# EAGLE design rpzc_1 (EAGLE 6.4)
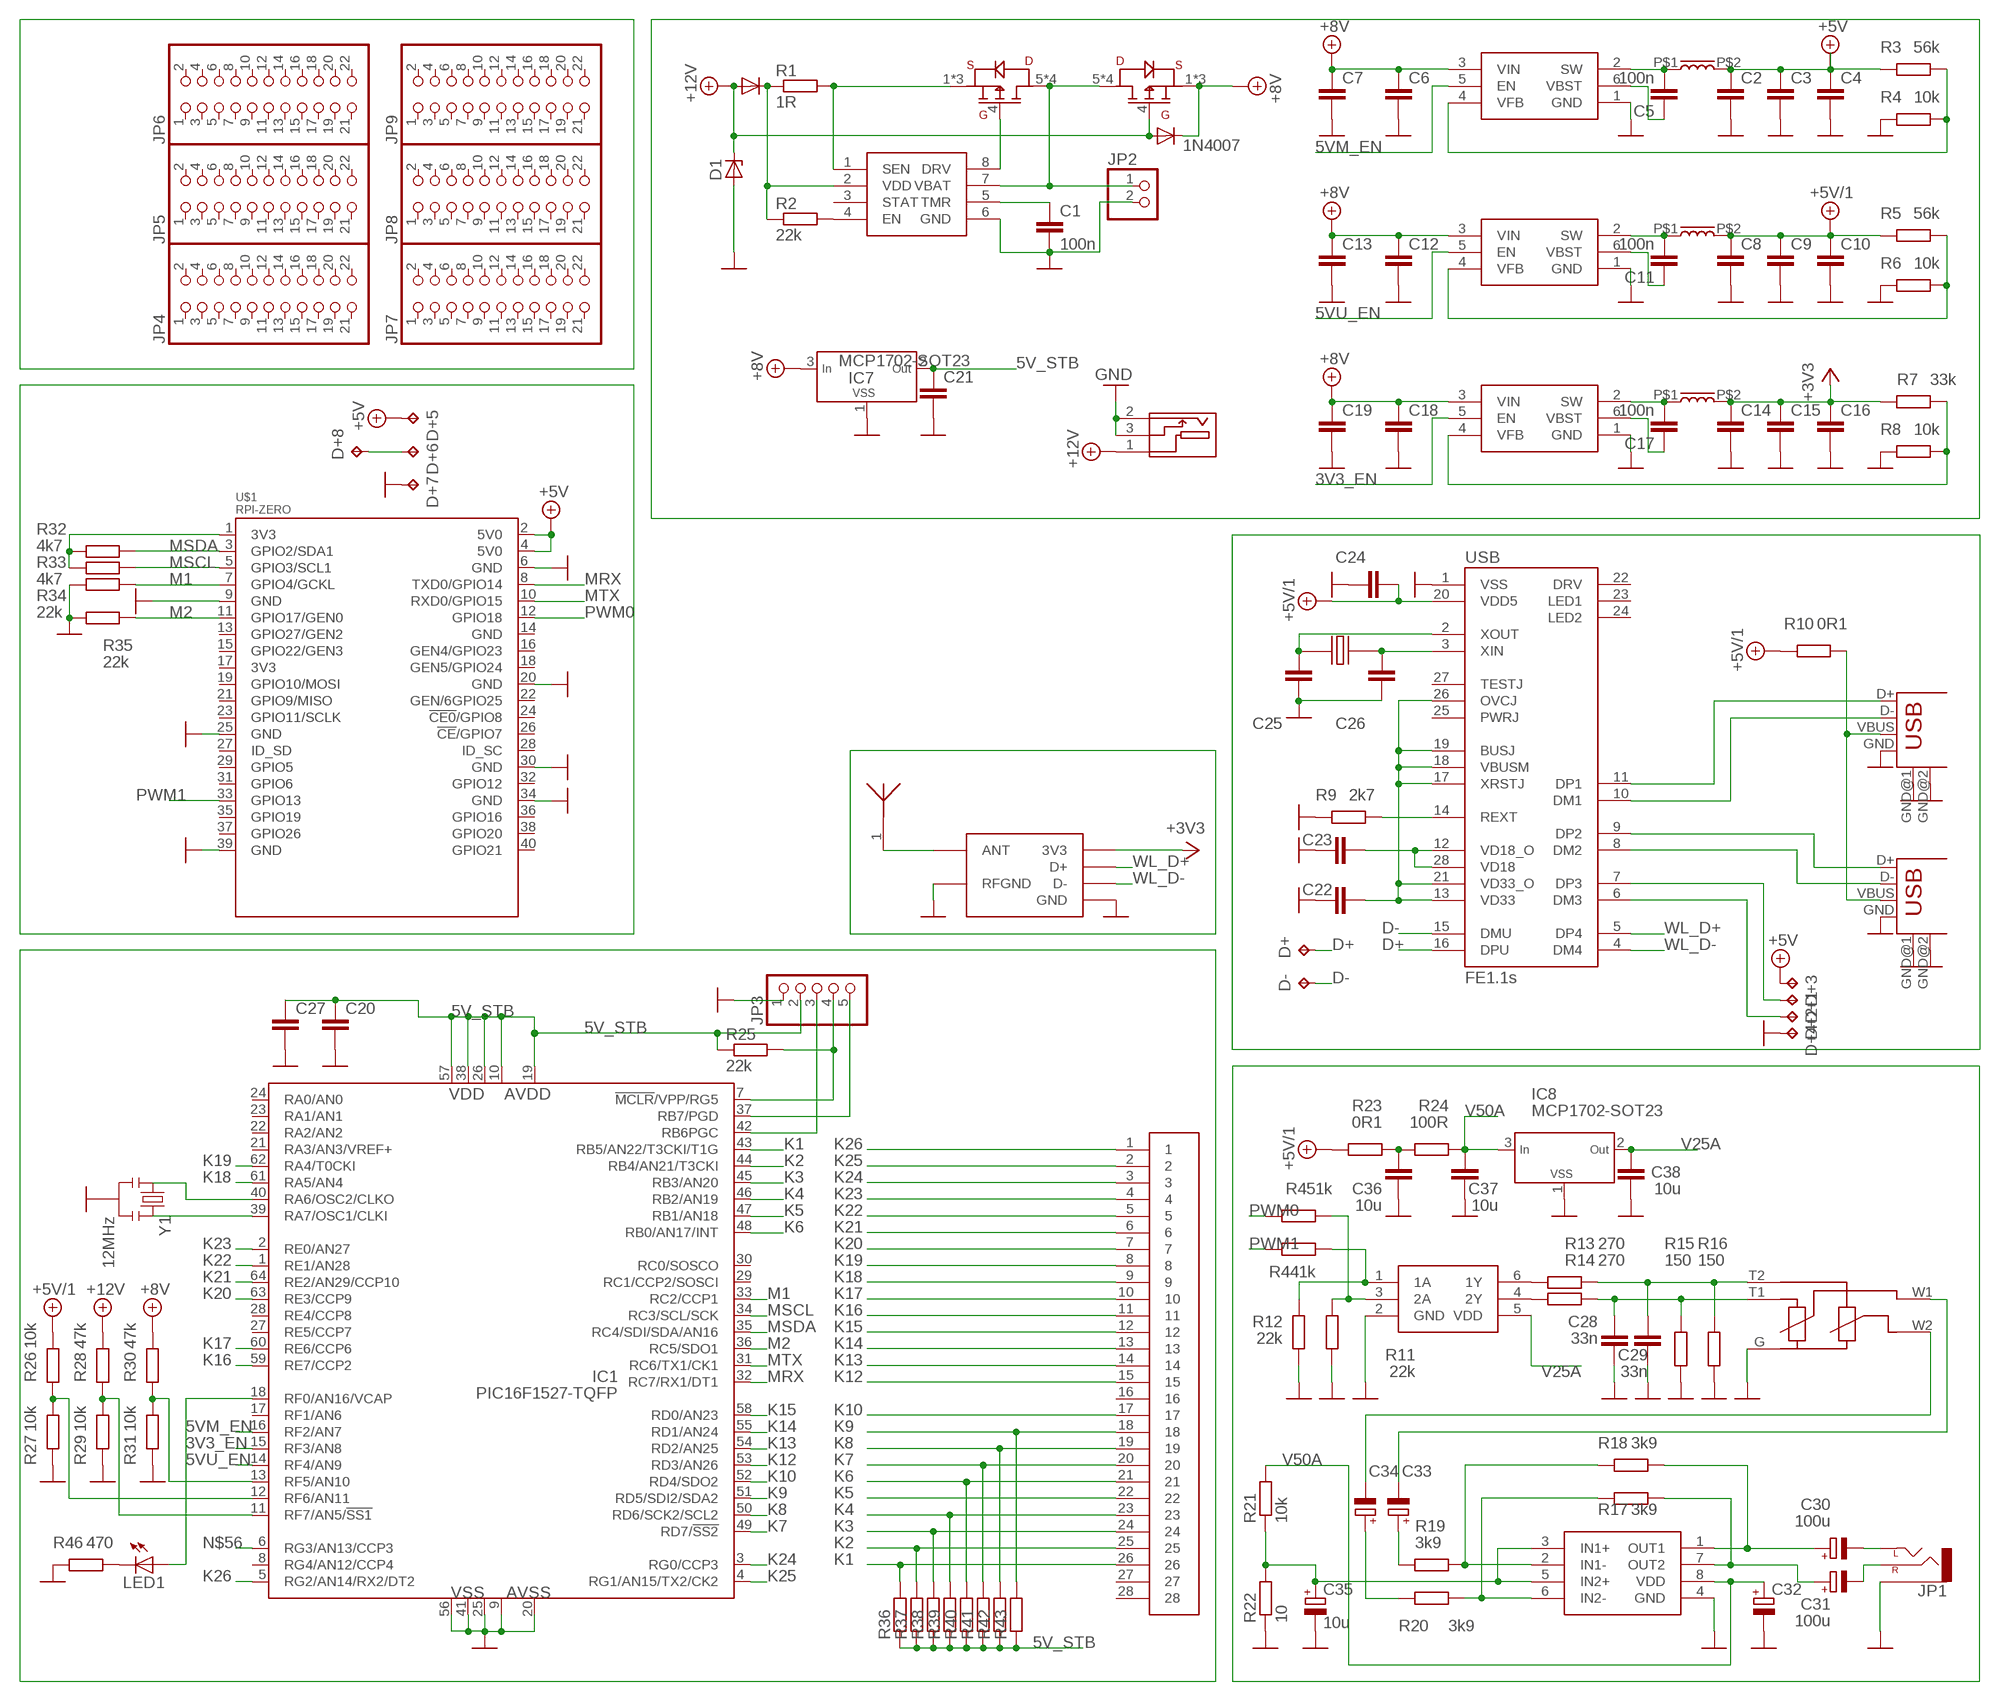
[diagram p0: schematic, sheet 1]

## Parts
ANT1  ANT_RAINSUN_24GHZ  [ANT_RAINSUN-24G]
C1  100n  C_0806  [R0805]
C2  C_0806  [R0805]
C3  C_0806  [R0805]
C4  C_0806  [R0805]
C5  100n  C_0806  [R0805]
C6  C_0806  [R0805]
C7  C_0806  [R0805]
C8  C_0806  [R0805]
C9  C_0806  [R0805]
C10  C_0806  [R0805]
C11  100n  C_0806  [R0805]
C12  C_0806  [R0805]
C13  C_0806  [R0805]
C14  C_0806  [R0805]
C15  C_0806  [R0805]
C16  C_0806  [R0805]
C17  100n  C_0806  [R0805]
C18  C_0806  [R0805]
C19  C_0806  [R0805]
C20  C_0806  [R0805]
C21  C_0806  [R0805]
C22  C_0806  [R0805]
C23  C_0806  [R0805]
C24  C_0806  [R0805]
C25  C_0806  [R0805]
C26  C_0806  [R0805]
C27  C_0806  [R0805]
C28  33n  C_0806  [R0805]
C29  33n  C_0806  [R0805]
C30  100u  CPOL-EUD  [PANASONIC_D]
C31  100u  CPOL-EUD  [PANASONIC_D]
C32  CPOL-EUD  [PANASONIC_D]
C33  CPOL-EUB  [PANASONIC_B]
C34  CPOL-EUB  [PANASONIC_B]
C35  10u  CPOL-EUB  [PANASONIC_B]
C36  10u  C_0806  [R0805]
C37  10u  C_0806  [R0805]
C38  10u  C_0806  [R0805]
CON1  CONN-28_1_K  [CONN_FFC_28_1_K]
D1  ZENER-DIODESMB  [SMB]
D2  1N4007  DIODE-SMB  [SMB]
D5  DIODE-SMB  [SMB]
D+  TPTP14R  [TP14R]
D+1  TPTP14R  [TP14R]
D+2  TPTP14R  [TP14R]
D+3  TPTP14R  [TP14R]
D+4  TPTP14R  [TP14R]
D+5  TPTP14R  [TP14R]
D+6  TPTP14R  [TP14R]
D+7  TPTP14R  [TP14R]
D+8  TPTP14R  [TP14R]
D-  TPTP14R  [TP14R]
IC1  PIC16F1527-TQFP  [TQFP64-10X10]
IC2  74LVC2G34  [SOT23-6]
IC3  TPS562200  [SOT23-6]
IC4  MCP73844  [MSOP8]
IC5  TPS562200  [SOT23-6]
IC6  TPS562200  [SOT23-6]
IC7  MCP1702-SOT23  [SOT23]
IC8  MCP1702-SOT23  [SOT23]
JP1  AUDIO-JACKPTH  [AUDIO-JACK]
JP2  PINHD-1X02_2.54-90°  [1X02/90]
JP3  PINHD-1X05_2.00  [1X05M]
JP4  PINHD-2X11_2.54  [2X11]
JP5  PINHD-2X11_2.54  [2X11]
JP6  PINHD-2X11_2.54  [2X11]
JP7  PINHD-2X11_2.54  [2X11]
JP8  PINHD-2X11_2.54  [2X11]
JP9  PINHD-2X11_2.54  [2X11]
LED1  LEDCHIPLED_0805  [CHIPLED_0805]
MOD1  MOD_USB_RTL8188  [MOD_USB_RTL8188]
R1  1R  R_1206  [R1206]
R2  22k  R_0805  [R0805]
R3  56k  R_0805  [R0805]
R4  10k  R_0805  [R0805]
R5  56k  R_0805  [R0805]
R6  10k  R_0805  [R0805]
R7  33k  R_0805  [R0805]
R8  10k  R_0805  [R0805]
R9  2k7  R_0805  [R0805]
R10  0R1  R_1206  [R1206]
R11  22k  R_0805  [R0805]
R12  22k  R_0805  [R0805]
R13  270  R_0805  [R0805]
R14  270  R_0805  [R0805]
R15  150  R_0805  [R0805]
R16  150  R_0805  [R0805]
R17  3k9  R_0805  [R0805]
R18  3k9  R_0805  [R0805]
R19  3k9  R_0805  [R0805]
R20  3k9  R_0805  [R0805]
R21  10k  R_0805  [R0805]
R22  10  R_0805  [R0805]
R23  0R1  R_1206  [R1206]
R24  100R  R_0805  [R0805]
R25  22k  R_0805  [R0805]
R26  10k  R_0805  [R0805]
R27  10k  R_0805  [R0805]
R28  47k  R_0805  [R0805]
R29  10k  R_0805  [R0805]
R30  47k  R_0805  [R0805]
R31  10k  R_0805  [R0805]
R32  4k7  R_0805  [R0805]
R33  4k7  R_0805  [R0805]
R34  22k  R_0805  [R0805]
R35  22k  R_0805  [R0805]
R36  R_0805  [R0805]
R37  R_0805  [R0805]
R38  R_0805  [R0805]
R39  R_0805  [R0805]
R40  R_0805  [R0805]
R41  R_0805  [R0805]
R42  R_0805  [R0805]
R43  R_0805  [R0805]
R44  1k  R_0805  [R0805]
R45  1k  R_0805  [R0805]
R46  470  R_0805  [R0805]
T1  PFET_SO8  [SO-08]
T2  PFET_SO8  [SO-08]
U$1  RPI-ZERO  [RASPBERRYPI_BASTELSTUBE_V13_RASPI_BOARD_B+_FULL]
U$2  POT_DUAL_14X2  [POT_14X2DUAL]
U$3  TDA1308  [SO-08]
U$4  2u2  INDUCTORBOURNS_SRP7030  [BOURNS_SRP7030]
U$5  2u2  INDUCTORBOURNS_SRP7030  [BOURNS_SRP7030]
U$6  CONN_DC_13  [CON_DC13]
U$8  2u2  INDUCTORBOURNS_SRP7030  [BOURNS_SRP7030]
USB  FE1.1S  [FE1.1S_SSOP-28]
USB1  USB-A-H  [USB-A-H]
USB2  USB-A-H  [USB-A-H]
X1  CRYST_TC26TC38  [TC38]
Y1  12MHz  RESONATORSMD  [RESONATOR-SMD]

## Nets
3V3@1: R32.1 R33.1 U$1.1(3V3)
3V3_EN: IC1.15(RF3/AN8) IC6.5(EN)
5V_STB: C20.1 C21.1 C27.1 IC1.10(VDD) IC1.19(AVDD) IC1.26(VDD) IC1.38(VDD) IC1.57(VDD) IC7.2(OUT) JP3.2 R25.1 R36.1 R37.1 R38.1 R39.1 R40.1 R41.1 R42.1 R43.1
5VM_EN: IC1.16(RF2/AN7) IC3.5(EN)
5VU_EN: IC1.14(RF4/AN9) IC5.5(EN)
+3V3: C14.1 C15.1 C16.1 MOD1.3V3 R7.1 U$5.P$2
+5V: C2.1 C3.1 C4.1 D+3.TP D+5.TP R3.1 U$1.2(5V0) U$1.4(5V0) U$8.P$2
+5V/1: C8.1 C9.1 C10.1 C24.2 R5.1 R10.2 R23.2 R26.2 U$4.P$2 USB.20(VDD5)
+8V: C6.1 C7.1 C12.1 C13.1 C18.1 C19.1 D2.C IC3.3(VIN) IC5.3(VIN) IC6.3(VIN) IC7.3(IN) R30.2 T2.1(S) T2.2(S) T2.3(S)
+12V: D1.C D2.A D5.A R28.2 T2.4(G) U$6.1(P)
D+: D+.TP USB.16(DPU)
D-: D-.TP USB.15(DMU)
GND: C1.2 C2.2 C3.2 C4.2 C6.2 C7.2 C8.2 C9.2 C10.2 C12.2 C13.2 C14.2 C15.2 C16.2 C18.2 C19.2 C20.2 C21.2 C22.1 C23.1 C24.1 C25.1 C26.1 C27.2 C28.1 C29.1 C32.- C35.- C36.1 C37.1 C38.1 D1.A D+4.TP D+7.TP IC1.9(VSS) IC1.20(AVSS) IC1.25(VSS) IC1.41(VSS) IC1.56(VSS) IC2.2(GND) IC3.1(GND) IC4.6(GND) IC5.1(GND) IC6.1(GND) IC7.1(VSS) IC8.1(VSS) JP1.SLEEVE JP2.2 JP3.1 MOD1.GND MOD1.RFGND R4.1 R6.1 R8.1 R9.1 R11.1 R12.1 R15.2 R16.2 R22.1 R27.1 R29.1 R31.1 R34.1 R35.1 R46.1 U$1.6(GND) U$1.9(GND) U$1.20(GND) U$1.25(GND) U$1.30(GND) U$1.34(GND) U$1.39(GND) U$2.G U$3.4(GND) U$6.2(N) U$6.3(SW) USB1.GND USB1.GND@1(GND) USB1.GND@2(GND) USB2.GND USB2.GND@1(GND) USB2.GND@2(GND) USB.1(VSS) Y1.2
K1: CON1.26 IC1.43(RB5/AN22/T3CKI/T1G) R36.2
K2: CON1.25 IC1.44(RB4/AN21/T3CKI) R37.2
K3: CON1.24 IC1.45(RB3/AN20) R38.2
K4: CON1.23 IC1.46(RB2/AN19) R39.2
K5: CON1.22 IC1.47(RB1/AN18)
K6: CON1.21 IC1.48(RB0/AN17/INT) R40.2
K7: CON1.20 IC1.49(RD7/!SS2) R41.2
K8: CON1.19 IC1.50(RD6/SCK2/SCL2) R42.2
K9: CON1.18 IC1.51(RD5/SDI2/SDA2) R43.2
K10: CON1.17 IC1.52(RD4/SDO2)
K12: CON1.15 IC1.53(RD3/AN26)
K13: CON1.14 IC1.54(RD2/AN25)
K14: CON1.13 IC1.55(RD1/AN24)
K15: CON1.12 IC1.58(RD0/AN23)
K16: CON1.11 IC1.59(RE7/CCP2)
K17: CON1.10 IC1.60(RE6/CCP6)
K18: CON1.9 IC1.61(RA5/AN4)
K19: CON1.8 IC1.62(RA4/T0CKI)
K20: CON1.7 IC1.63(RE3/CCP9)
K21: CON1.6 IC1.64(RE2/AN29/CCP10)
K22: CON1.5 IC1.1(RE1/AN28)
K23: CON1.4 IC1.2(RE0/AN27)
K24: CON1.3 IC1.3(RG0/CCP3)
K25: CON1.2 IC1.4(RG1/AN15/TX2/CK2)
K26: CON1.1 IC1.5(RG2/AN14/RX2/DT2)
M1: IC1.33(RC2/CCP1) R34.2 U$1.7(GPIO4/GCKL)
M2: IC1.36(RC5/SDO1) R35.2 U$1.11(GPIO17/GEN0)
MRX: IC1.32(RC7/RX1/DT1) U$1.8(TXD0/GPIO14)
MSCL: IC1.34(RC3/SCL/SCK) R33.2 U$1.5(GPIO3/SCL1)
MSDA: IC1.35(RC4/SDI/SDA/AN16) R32.2 U$1.3(GPIO2/SDA1)
MTX: IC1.31(RC6/TX1/CK1) U$1.10(RXD0/GPIO15)
N$1: C5.2 IC3.2(SW) U$8.P$1
N$2: D5.C IC4.2(VDD) R1.1 R2.1
N$3: IC4.1(SEN) R1.2 T1.1(S) T1.2(S) T1.3(S)
N$4: IC4.8(DRV) T1.4(G)
N$5: IC4.4(EN) R2.2
N$6: C1.1 IC4.5(TMR)
N$7: IC4.7(VBAT) JP2.1 T1.5(D) T1.6(D) T1.7(D) T1.8(D) T2.5(D) T2.6(D) T2.7(D) T2.8(D)
N$8: USB2.D+ USB.9(DP2)
N$9: USB2.D- USB.8(DM2)
N$10: USB1.D- USB.10(DM1)
N$11: USB1.D+ USB.11(DP1)
N$12: C22.2 USB.13(VD33) USB.17(XRSTJ) USB.18(VBUSM) USB.19(BUSJ) USB.21(VD33_O) USB.26(OVCJ)
N$13: C5.1 IC3.6(VBST)
N$14: IC3.4(VFB) R3.2 R4.2
N$15: C23.2 USB.12(VD18_O) USB.28(VD18)
N$16: R9.2 USB.14(REXT)
N$17: C11.2 IC5.2(SW) U$4.P$1
N$18: C25.2 USB.2(XOUT) X1.P$1
N$19: C11.1 IC5.6(VBST)
N$20: IC5.4(VFB) R5.2 R6.2
N$21: C26.2 USB.3(XIN) X1.P$2
N$22: C17.2 IC6.2(SW) U$5.P$1
N$23: R10.1 USB1.VBUS USB2.VBUS
N$24: C17.1 IC6.6(VBST)
N$25: IC6.4(VFB) R7.2 R8.2
N$29: IC2.6(1Y) R13.2
N$30: IC2.4(2Y) R14.2
N$31: C29.2 R13.1 R16.1 U$2.T2
N$32: C28.2 R14.1 R15.1 U$2.T1
N$33: ANT1.1 MOD1.ANT
N$34: C30.- JP1.TIP(LEFT)
N$35: C31.- JP1.RING(RIGHT)
N$36: C30.+ R18.2 U$3.1(OUT1)
N$37: C31.+ R17.2 U$3.7(OUT2)
N$38: C35.+ R21.1 R22.2 U$3.3(IN1+) U$3.5(IN2+)
N$39: R18.1 R19.2 U$3.2(IN1-)
N$40: R17.1 R20.2 U$3.6(IN2-)
N$41: C33.+ R19.1
N$42: C34.+ R20.1
N$43: C34.- U$2.W2
N$44: C33.- U$2.W1
N$45: D+1.TP USB.7(DP3)
N$46: D+2.TP USB.6(DM3)
N$47: C36.2 R23.1 R24.1
N$48: IC1.12(RF6/AN11) R26.1 R27.2
N$49: IC1.7(!MCLR!/VPP/RG5) JP3.4 R25.2
N$50: IC1.37(RB7/PGD) JP3.5
N$51: IC1.42(RB6PGC) JP3.3
N$52: IC1.11(RF7/AN5/!SS1) R28.1 R29.2
N$53: IC1.40(RA6/OSC2/CLKO) Y1.1
N$54: IC1.39(RA7/OSC1/CLKI) Y1.3
N$55: IC1.13(RF5/AN10) R30.1 R31.2
N$56: IC1.6(RG3/AN13/CCP3)
N$57: D+6.TP D+8.TP
N$58: IC2.3(2A) R11.2 R45.1
N$59: IC2.1(1A) R12.2 R44.1
N$60: LED1.C R46.2
N$61: IC1.18(RF0/AN16/VCAP) LED1.A
PWM0: R45.2 U$1.12(GPIO18)
PWM1: R44.2 U$1.33(GPIO13)
V25A: C38.2 IC2.5(VDD) IC8.2(OUT)
V50A: C32.+ C37.2 IC8.3(IN) R21.2 R24.2 U$3.8(VDD)
WL_D+: MOD1.D+ USB.5(DP4)
WL_D-: MOD1.D- USB.4(DM4)
Unconnected: CON1.16 CON1.27 CON1.28 IC1.8(RG4/AN12/CCP4) IC1.17(RF1/AN6) IC1.21(RA3/AN3/VREF+) IC1.22(RA2/AN2) IC1.23(RA1/AN1) IC1.24(RA0/AN0) IC1.27(RE5/CCP7) IC1.28(RE4/CCP8) IC1.29(RC1/CCP2/SOSCI) IC1.30(RC0/SOSCO) IC4.3(STAT) JP4.1 JP4.2 JP4.3 JP4.4 JP4.5 JP4.6 JP4.7 JP4.8 JP4.9 JP4.10 JP4.11 JP4.12 JP4.13 JP4.14 JP4.15 JP4.16 JP4.17 JP4.18 JP4.19 JP4.20 JP4.21 JP4.22 JP5.1 JP5.2 JP5.3 JP5.4 JP5.5 JP5.6 JP5.7 JP5.8 JP5.9 JP5.10 JP5.11 JP5.12 JP5.13 JP5.14 JP5.15 JP5.16 JP5.17 JP5.18 JP5.19 JP5.20 JP5.21 JP5.22 JP6.1 JP6.2 JP6.3 JP6.4 JP6.5 JP6.6 JP6.7 JP6.8 JP6.9 JP6.10 JP6.11 JP6.12 JP6.13 JP6.14 JP6.15 JP6.16 JP6.17 JP6.18 JP6.19 JP6.20 JP6.21 JP6.22 JP7.1 JP7.2 JP7.3 JP7.4 JP7.5 JP7.6 JP7.7 JP7.8 JP7.9 JP7.10 JP7.11 JP7.12 JP7.13 JP7.14 JP7.15 JP7.16 JP7.17 JP7.18 JP7.19 JP7.20 JP7.21 JP7.22 JP8.1 JP8.2 JP8.3 JP8.4 JP8.5 JP8.6 JP8.7 JP8.8 JP8.9 JP8.10 JP8.11 JP8.12 JP8.13 JP8.14 JP8.15 JP8.16 JP8.17 JP8.18 JP8.19 JP8.20 JP8.21 JP8.22 JP9.1 JP9.2 JP9.3 JP9.4 JP9.5 JP9.6 JP9.7 JP9.8 JP9.9 JP9.10 JP9.11 JP9.12 JP9.13 JP9.14 JP9.15 JP9.16 JP9.17 JP9.18 JP9.19 JP9.20 JP9.21 JP9.22 U$1.13(GPIO27/GEN2) U$1.14(GND) U$1.15(GPIO22/GEN3) U$1.16(GEN4/GPIO23) U$1.17(3V3) U$1.18(GEN5/GPIO24) U$1.19(GPIO10/MOSI) U$1.21(GPIO9/MISO) U$1.22(GEN/6GPIO25) U$1.23(GPIO11/SCLK) U$1.24(!CE0!/GPIO8) U$1.26(!CE!/GPIO7) U$1.27(ID_SD) U$1.28(ID_SC) U$1.29(GPIO5) U$1.31(GPIO6) U$1.32(GPIO12) U$1.35(GPIO19) U$1.36(GPIO16) U$1.37(GPIO26) U$1.38(GPIO20) U$1.40(GPIO21) USB.22(DRV) USB.23(LED1) USB.24(LED2) USB.25(PWRJ) USB.27(TESTJ)

## Library data of the parts
ANT1 = _moja:ANT_RAINSUN_24GHZ
C1-C29 C36-C38 = _moja:C
C30-C35 = _rcl:CPOL-EU: POLARIZED CAPACITOR, European symbol
CON1 = _moja:CONN-28_1_K
D1 = diode:ZENER-DIODE: Z-Diode
D2 D5 = diode:DIODE-: DIODE
D+ D+1-D+8 D- = testpad:TP: Test pad
IC1 = _mcom5:PIC16F1527
IC2 = _mcom6:74LVC2G34
IC3 IC5 IC6 = _mcom6:TPS562200
IC4 = _mcom6:MCP73844
IC7 IC8 = _mcom6:MCP1702
JP1 = SparkFun-Connectors:AUDIO-JACK: 3.5mm Audio Jack Simple 3.5mm common PCB mount audio jack. SKU: PRT-08032
JP2 = pinhead-2:PINHD-1X02: PIN HEADER
JP3 = pinhead-2:PINHD-1X05: PIN HEADER
JP4-JP9 = pinhead-2:PINHD-2X11: PIN HEADER
LED1 = led:LED: LED OSRAM: - CHIPLED LG R971, LG N971, LY N971, LG Q971, LY Q971, LO R971, LY R971 LH N974, LH R974 LS Q976, LO Q976, LY Q976 LO Q996 - Hyper CHIPLED LW Q18S LB Q993, LB Q99A, LB R99A - SideLED LS A670, LO A670, LY A670, LG A670, LP A670 LB A673, LV A673, LT A673, LW A673 LH A674 LY A675 LS A676, LA A676, LO A676, LY A676, LW A676 LS A679, LY A679, LG A679 - Hyper Micro SIDELED® LS Y876, LA Y876, LO Y876, LY Y876 LT Y87S - SmartLED LW L88C, LW L88S LB L89C, LB L89S, LG L890 LS L89K, LO L89K, LY L89K LS L896, LA L896, LO L896, LY L896 - TOPLED LS T670, LO T670, LY T670, LG T670, LP T670 LSG T670, LSP T670, LSY T670, LOP T670, LYG T670 LG T671, LOG T671, LSG T671 LB T673, LV T673, LT T673, LW T673 LH T674 LS T676, LA T676, LO T676, LY T676, LB T676, LH T676, LSB T676, LW T676 LB T67C, LV T67C, LT T67C, LS T67K, LO T67K, LY T67K, LW E67C LS E67B, LA E67B, LO E67B, LY E67B, LB E67C, LV E67C, LT E67C LW T67C LS T679, LY T679, LG T679 LS T770, LO T770, LY T770, LG T770, LP T770 LB T773, LV T773, LT T773, LW T773 LH T774 LS E675, LA E675, LY E675, LS T675 LS T776, LA T776, LO T776, LY T776, LB T776 LHGB T686 LT T68C, LB T68C - Hyper Mini TOPLED® LB M676 - Mini TOPLED Santana® LG M470 LS M47K, LO M47K, LY M47K Source: http://www.osram.convergy.de LUXEON: - LUMILED® LXK2-PW12-R00, LXK2-PW12-S00, LXK2-PW14-U00, LXK2-PW14-V00 LXK2-PM12-R00, LXK2-PM12-S00, LXK2-PM14-U00 LXK2-PE12-Q00, LXK2-PE12-R00, LXK2-PE12-S00, LXK2-PE14-T00, LXK2-PE14-U00 LXK2-PB12-K00, LXK2-PB12-L00, LXK2-PB12-M00, LXK2-PB14-N00, LXK2-PB14-P00, LXK2-PB14-Q00 LXK2-PR12-L00, LXK2-PR12-M00, LXK2-PR14-Q00, LXK2-PR14-R00 LXK2-PD12-Q00, LXK2-PD12-R00, LXK2-PD12-S00 LXK2-PH12-R00, LXK2-PH12-S00 LXK2-PL12-P00, LXK2-PL12-Q00, LXK2-PL12-R00 Source: www.luxeon.com KINGBRIGHT: KA-3528ASYC Source: www.kingbright.com
MOD1 = _moja:MOD_USB_RTL8188
R1-R46 = _moja:R
T1 T2 = _mcom6:PFET_SO8
U$1 = RPI-Zero:RPI-ZERO
U$2 = _moja:POT_DUAL_14X2
U$3 = _mcom6:TDA1308
U$4 U$5 U$8 = _mcs1:INDUCTOR
U$6 = _moja:CONN_DC_13
USB = imcom:FE1.1S: A USB 2.0 hub IC. http://www.jfd-ic.com/Documents/FE1.1s%20Data%20Sheet%20%28Rev.%201.0%29.pdf
USB1 USB2 = con-usb-2:USB: USB Connectors
X1 = _moja:CRYST_TC26
Y1 = SparkFun:RESONATOR: Resonator Small SMD resonator. This is the itty bitty 10/20MHz resonators with built in caps. CSTCE10M0G55 and CSTCE20M0V53. Footprint has been reviewed closely but hasn't been tested yet.

## Board
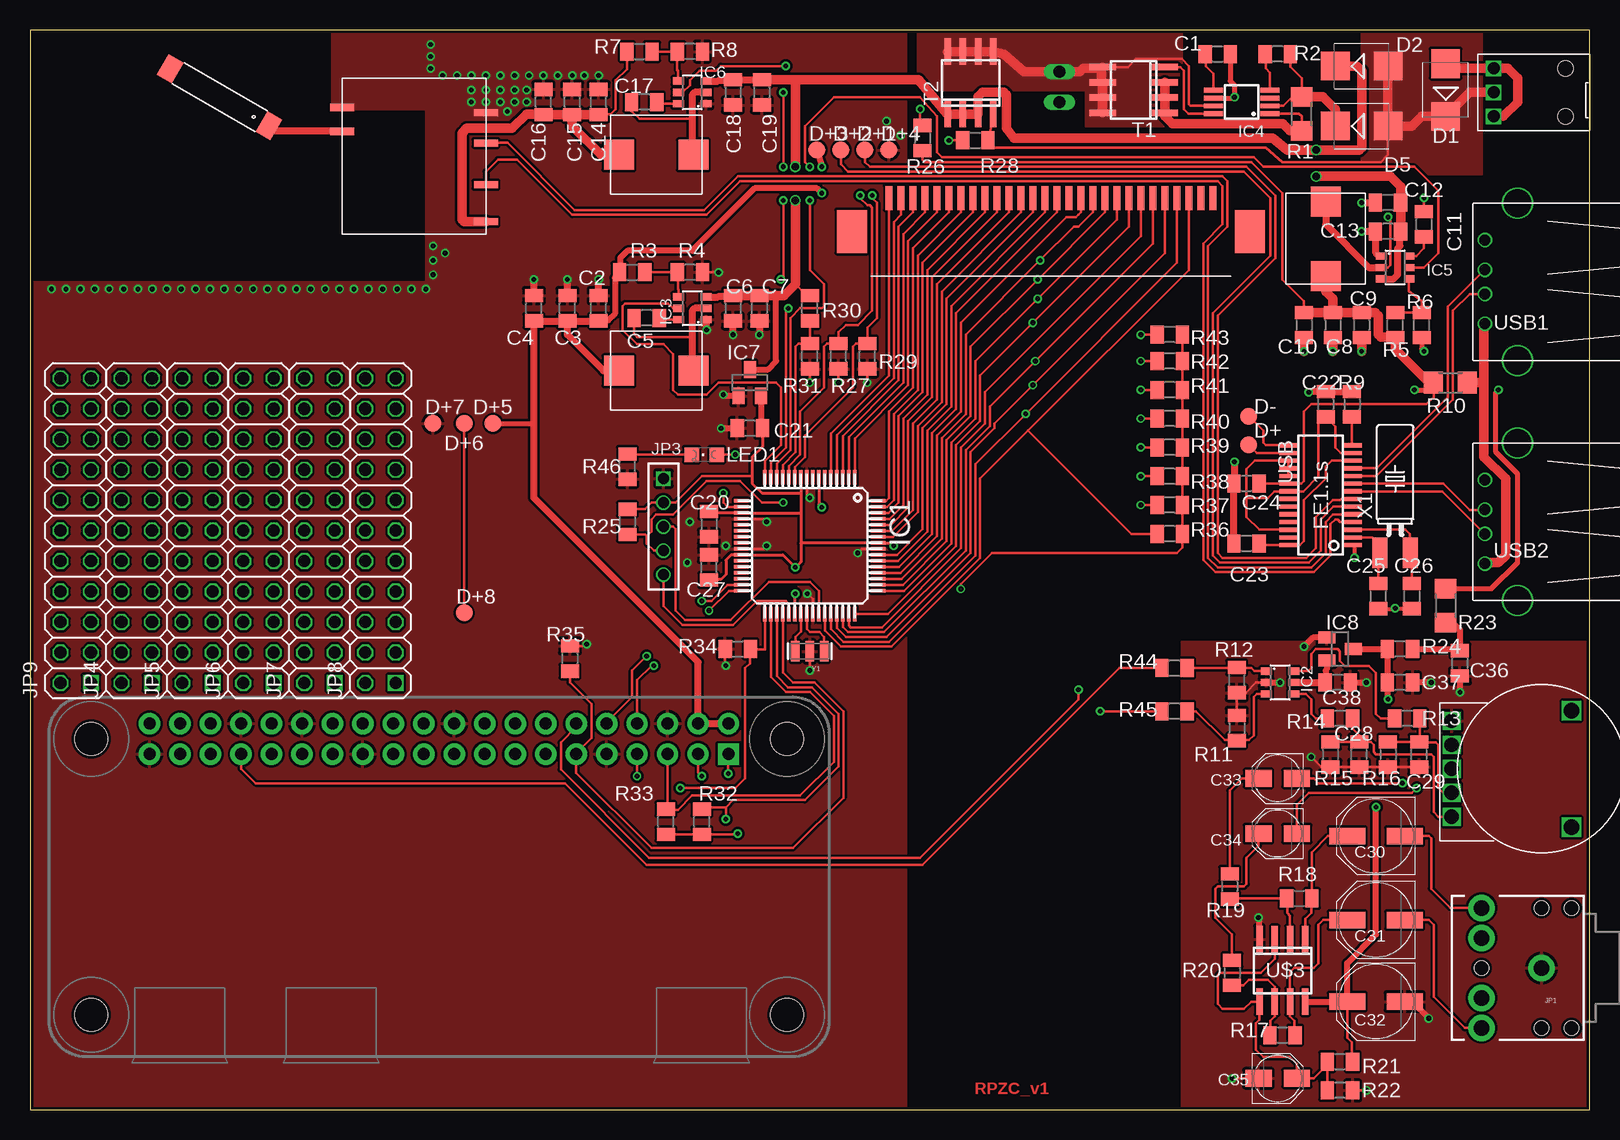
[diagram p1: board, top side]
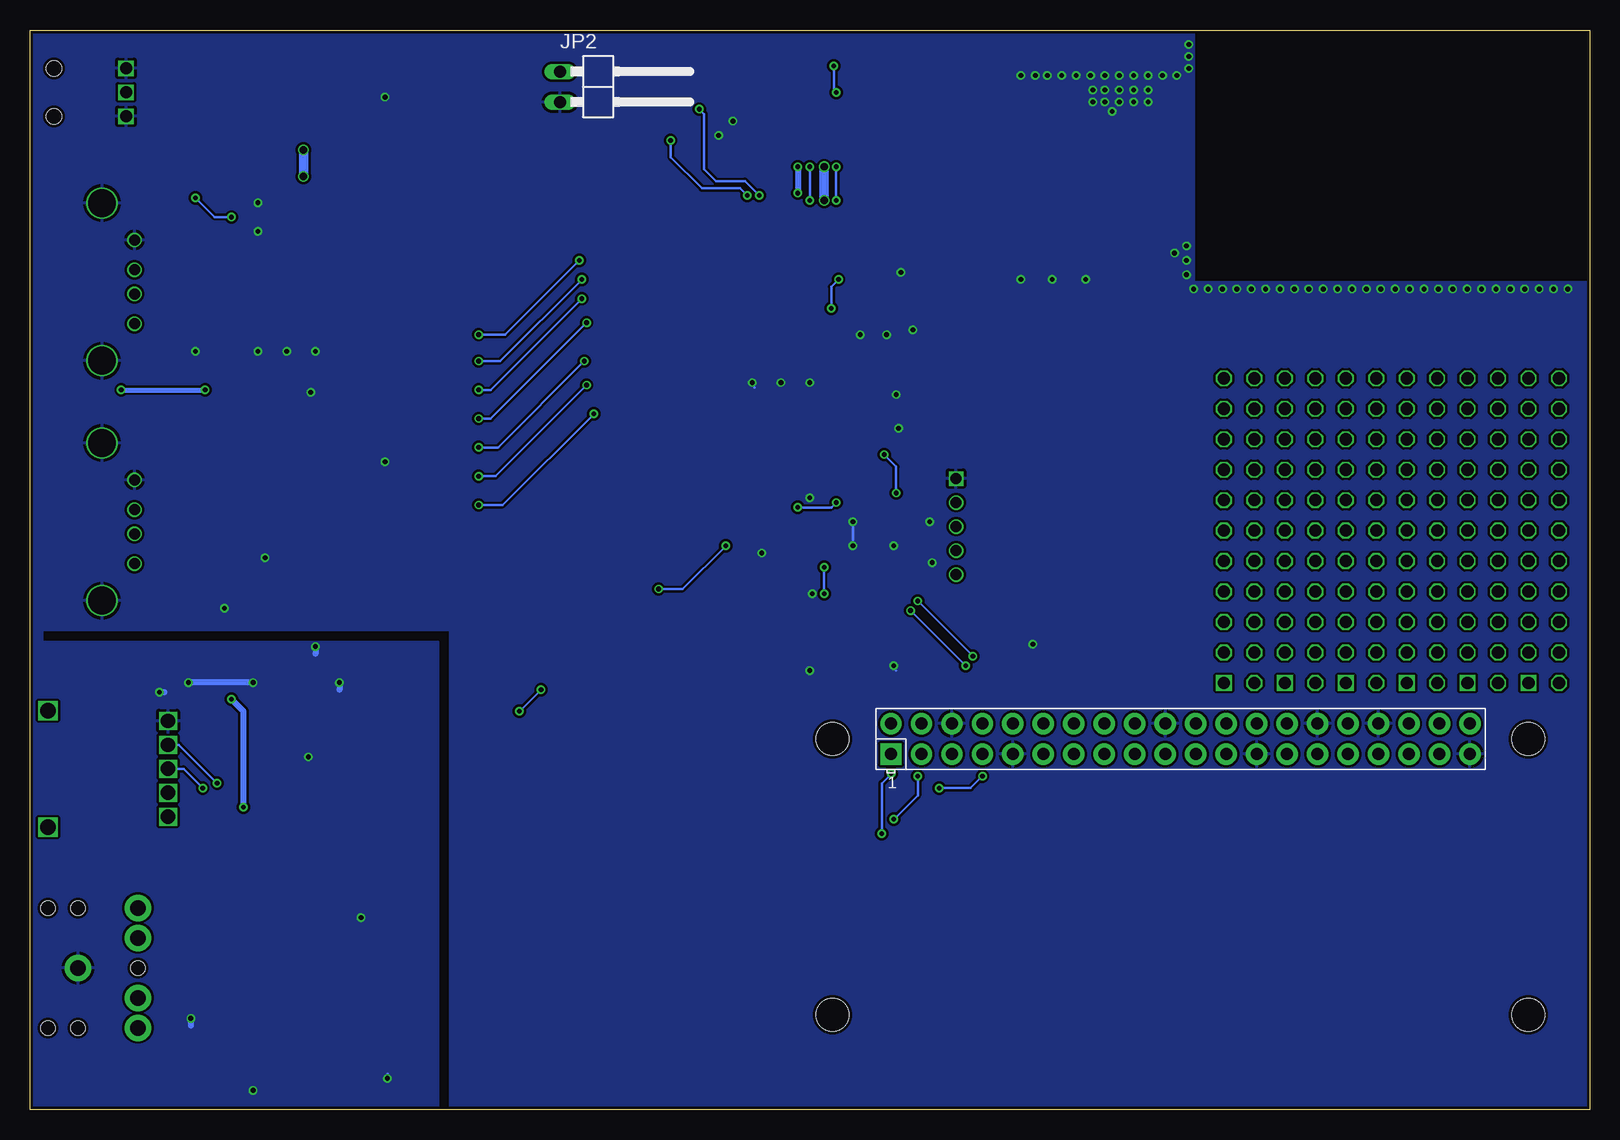
[diagram p2: board, bottom side, seen from below]

Size 130 x 90 mm. Coordinates in mm from the lower left corner, seen from the top.
Outline: 0,0 130,0 130,90 0,90 0,0
Copper layers (1*16): Top 0.035mm / dielectric 1.5mm / Bottom 0.035mm
Design rules "ch_6": minimum track width 0.15mm, minimum drill 0.4mm, track to track 0.2mm, track to pad 0.2mm, pad to pad 0.2mm, via to via 0.2mm, smd to smd 0.2mm, copper to edge 10mil, drill to drill 8mil, minimum pad ring 0.15mm, minimum via ring 0.15mm, stop-mask expansion 4mil, vias tented up to drill 0mil, thermal gap 10mil

### Footprints (pad centres in the part's own frame; a part is rotated, then mirrored left to right if it is on the bottom)
ANT_RAINSUN-24G = smd 2 x 1.4: 1 0,-4.75; 2 0,4.75
R0805 = smd 1.1 x 1.5: 1 -1.05,0; 2 1.05,0
PANASONIC_D = smd 3 x 1.4: + 2.4,0; - -2.4,0
PANASONIC_B = smd 2.2 x 1.4: + 1.6,0; - -1.6,0
CONN_FFC_28_1_K = smd 0.6 x 2: 1 -13.5,1; 2 -12.5,1; 3 -11.5,1; 4 -10.5,1; 5 -9.5,1; 6 -8.5,1; 7 -7.5,1; 8 -6.5,1; 9 -5.5,1; 10 -4.5,1; 11 -3.5,1; 12 -2.5,1; 13 -1.5,1; 14 -0.5,1; 15 0.5,1; 16 1.5,1; 17 2.5,1; 18 3.5,1; 19 4.5,1; 20 5.5,1; 21 6.5,1; 22 7.5,1; 23 8.5,1; 24 9.5,1; 25 10.5,1; 26 11.5,1; 27 12.5,1; 28 13.5,1 | smd 2.5 x 3.6: T1 -16.6,-1.8; T2 16.6,-1.8
SMB = smd 2.4 x 2.4: A 2.2,0; C -2.2,0
TP14R = smd 1.4 x 1.4: TP 0,0
TQFP64-10X10 = smd 1.2 x 0.254: 1 -5.7,3.75; 2 -5.7,3.25; 3 -5.7,2.75; 4 -5.7,2.25; 5 -5.7,1.75; 6 -5.7,1.25; 7 -5.7,0.75; 8 -5.7,0.25; 9 -5.7,-0.25; 10 -5.7,-0.75; 11 -5.7,-1.25; 12 -5.7,-1.75; 13 -5.7,-2.25; 14 -5.7,-2.75; 15 -5.7,-3.25; 16 -5.7,-3.75; 33 5.7,-3.75; 34 5.7,-3.25; 35 5.7,-2.75; 36 5.7,-2.25; 37 5.7,-1.75; 38 5.7,-1.25; 39 5.7,-0.75; 40 5.7,-0.25; 41 5.7,0.25; 42 5.7,0.75; 43 5.7,1.25; 44 5.7,1.75; 45 5.7,2.25; 46 5.7,2.75; 47 5.7,3.25; 48 5.7,3.75 | smd 0.254 x 1.2: 17 -3.75,-5.7; 18 -3.25,-5.7; 19 -2.75,-5.7; 20 -2.25,-5.7; 21 -1.75,-5.7; 22 -1.25,-5.7; 23 -0.75,-5.7; 24 -0.25,-5.7; 25 0.25,-5.7; 26 0.75,-5.7; 27 1.25,-5.7; 28 1.75,-5.7; 29 2.25,-5.7; 30 2.75,-5.7; 31 3.25,-5.7; 32 3.75,-5.7; 49 3.75,5.7; 50 3.25,5.7; 51 2.75,5.7; 52 2.25,5.7; 53 1.75,5.7; 54 1.25,5.7; 55 0.75,5.7; 56 0.25,5.7; 57 -0.25,5.7; 58 -0.75,5.7; 59 -1.25,5.7; 60 -1.75,5.7; 61 -2.25,5.7; 62 -2.75,5.7; 63 -3.25,5.7; 64 -3.75,5.7
SOT23-6 = smd 0.6 x 0.9: 1 -0.95,-1.15; 2 0,-1.15; 3 0.95,-1.15; 4 0.95,1.15; 5 0,1.15; 6 -0.95,1.15
MSOP8 = smd 0.4 x 1.6: 1 -0.975,-2.35; 2 -0.325,-2.35; 3 0.325,-2.35; 4 0.975,-2.35; 5 0.975,2.35; 6 0.325,2.35; 7 -0.325,2.35; 8 -0.975,2.35
SOT23 = smd 1 x 1.4: 1 -0.95,-1.1; 2 0.95,-1.1; 3 0,1.1
AUDIO-JACK = drill 1.3 pad 2.184: RING 5,5; RSH 5,2.5; SLEEVE 0,0; TIP 5,-5; TSH 5,-2.5 | hole 1.2: 0,5; -2.5,5; -2.5,-5; 0,-5; 5,0
1X02/90 = drill 1 long: 1 -2.54,-3.81; 2 0,-3.81
1X05M = drill 0.914 square: 1 -4,0 | drill 0.914: 2 -2,0; 3 0,0; 4 2,0; 5 4,0
2X11 = drill 1.016 square: 1 -12.7,-1.27 | drill 1.016 octagon: 2 -12.7,1.27; 3 -10.16,-1.27; 4 -10.16,1.27; 5 -7.62,-1.27; 6 -7.62,1.27; 7 -5.08,-1.27; 8 -5.08,1.27; 9 -2.54,-1.27; 10 -2.54,1.27; 11 0,-1.27; 12 0,1.27; 13 2.54,-1.27; 14 2.54,1.27; 15 5.08,-1.27; 16 5.08,1.27; 17 7.62,-1.27; 18 7.62,1.27; 19 10.16,-1.27; 20 10.16,1.27; 21 12.7,-1.27; 22 12.7,1.27
CHIPLED_0805 = smd 1.2 x 1.2: A 0,-1.05; C 0,1.05
MOD_USB_RTL8188 = smd 2 x 0.6: 3V3 12,-11.98; ANT 0,-4.45; D+ 12,-5.425; D- 12,-8.9; GND 12,-2.903; RFGND 0,-2.45
R1206 = smd 1.6 x 1.803: 1 -1.422,0; 2 1.422,0
SO-08 = smd 0.55 x 2.2: 1 -1.905,-2.6; 2 -0.635,-2.6; 3 0.635,-2.6; 4 1.905,-2.6; 5 1.905,2.6; 6 0.635,2.6; 7 -0.635,2.6; 8 -1.905,2.6
RASPBERRYPI_BASTELSTUBE_V13_RASPI_BOARD_B+_FULL = drill 1 pad 1.778 square: 1 8.37,25.23 | drill 1 pad 1.778: 2 8.37,27.77; 3 10.91,25.23; 4 10.91,27.77; 5 13.45,25.23; 6 13.45,27.77; 7 15.99,25.23; 8 15.99,27.77; 9 18.53,25.23; 10 18.53,27.77; 11 21.07,25.23; 12 21.07,27.77; 13 23.61,25.23; 14 23.61,27.77; 15 26.15,25.23; 16 26.15,27.77; 17 28.69,25.23; 18 28.69,27.77; 19 31.23,25.23; 20 31.23,27.77; 21 33.77,25.23; 22 33.77,27.77; 23 36.31,25.23; 24 36.31,27.77; 25 38.85,25.23; 26 38.85,27.77; 27 41.39,25.23; 28 41.39,27.77; 29 43.93,25.23; 30 43.93,27.77; 31 46.47,25.23; 32 46.47,27.77; 33 49.01,25.23; 34 49.01,27.77; 35 51.55,25.23; 36 51.55,27.77; 37 54.09,25.23; 38 54.09,27.77; 39 56.63,25.23; 40 56.63,27.77 | hole 2.75: 3.5,3.5; 3.5,26.5; 61.5,3.5; 61.5,26.5
POT_14X2DUAL = drill 1.2 square: G -4,-7.5; T1 4,-7.5; T2 2,-7.5; W1 -2,-7.5; W2 0,-7.5 | drill 1.3 square: P$1 -4.85,2.5; P$2 4.85,2.5
BOURNS_SRP7030 = smd 2.5 x 2.5: P$1 3.1,0; P$2 -3.1,0
CON_DC13 = drill 1 square: 1 8,3.2; 2 8,1.2; 3 8,5.2 | hole 1.3: 2,5.2; 2,1.2
FE1.1S_SSOP-28 = smd 0.35 x 1.5: 1 -4.16,-2.7; 2 -3.52,-2.7; 3 -2.88,-2.7; 4 -2.24,-2.7; 5 -1.6,-2.7; 6 -0.96,-2.7; 7 -0.32,-2.7; 8 0.32,-2.7; 9 0.96,-2.7; 10 1.6,-2.7; 11 2.24,-2.7; 12 2.88,-2.7; 13 3.52,-2.7; 14 4.16,-2.7; 15 4.16,2.7; 16 3.52,2.7; 17 2.88,2.7; 18 2.24,2.7; 19 1.6,2.7; 20 0.96,2.7; 21 0.32,2.7; 22 -0.3,2.7; 23 -0.96,2.7; 24 -1.6,2.7; 25 -2.24,2.7; 26 -2.88,2.7; 27 -3.52,2.7; 28 -4.16,2.7
USB-A-H = drill 0.914: D+ 2.718,-1.003; D- 2.718,1.003; GND 2.718,-3.493; VBUS 2.718,3.493 | drill 2.311: GND@1 0,6.566; GND@2 0,-6.566
TC38 = smd 1.27 x 2.54: P$1 -1.27,-4.572; P$2 1.27,-4.572
RESONATOR-SMD = smd 0.7 x 1.7: 1 -1.2,0; 2 0,0; 3 1.2,0

### Placement (x,y rotation side)
ANT1  15.8,84.4 60 top
C1  99,88 0 top
C2  47.4,66.8 90 top
C3  44.8,66.8 90 top
C4  42,66.8 90 top
C5  51.4,66 180 top
C6  58.6,66.8 270 top
C7  60.8,66.8 270 top
C8  108.6,65.4 270 top
C9  111,65.4 270 top
C10  106.2,65.4 270 top
C11  116.2,73.8 90 top
C12  113.2,75.6 180 top
C13  113.2,73.2 180 top
C14  47.4,84 90 top
C15  45.2,84 90 top
C16  42.8,84 90 top
C17  51.2,84 180 top
C18  58.6,84.8 270 top
C19  61,84.8 270 top
C20  56.6,48.8 270 top
C21  60,56.8 180 top
C22  108,58.8 270 top
C23  101.4,47.2 0 top
C24  101.4,52.2 0 top
C25  112.4,42.8 90 top
C26  115.2,42.8 90 top
C27  56.6,45.2 90 top
C28  110.8,29.6 90 top
C29  115.8,29.6 90 top
C30  112.2,22.8 180 top
C31  112.2,15.8 180 top
C32  112.2,9 180 top
C33  104,27.6 180 top
C34  104,23 180 top
C35  104,2.6 0 top
C36  119.2,37.2 90 top
C37  114.2,35.6 180 top
C38  109,35.6 180 top
CON1  85.1,75 0 top
D1  118,85 90 top
D2  111,87 0 top
D5  111,82 0 top
D+  101.6,55.4 0 top
D+1  69.6,80 0 top
D+2  67.6,80 0 top
D+3  65.6,80 0 top
D+4  71.6,80 0 top
D+5  38.6,57.2 0 top
D+6  36.2,57.2 0 top
D+7  33.6,57.2 0 top
D+8  36.2,41.4 0 top
D-  101.6,57.8 0 top
IC1  65,47 270 top
IC2  104.2,35.6 270 top
IC3  55.2,66.8 90 top
IC4  101,84 90 top
IC5  113.8,70.2 270 top
IC6  55.2,84.8 90 top
IC7  60,60.6 0 top
IC8  109.2,38.4 270 top
JP1  126,11.8 180 top
JP2  82,84 270 bottom
JP3  52.8,48.6 270 top
JP4  8.89,48.26 90 top
JP5  13.97,48.26 90 top
JP6  19.05,48.26 90 top
JP7  24.13,48.26 90 top
JP8  29.21,48.26 90 top
JP9  3.81,48.26 90 top
LED1  56.2,54.6 90 top
MOD1  26,86 0 top
R1  106,83 270 top
R2  104,88 180 top
R3  50.2,69.8 0 top
R4  55,69.8 180 top
R5  113.8,65.4 90 top
R6  116,65.4 90 top
R7  50.8,88.2 0 top
R8  55,88.2 180 top
R9  110.2,58.8 270 top
R10  118.4,60.6 180 top
R11  100.6,31.8 270 top
R12  100.6,35.8 90 top
R13  114.8,32.6 180 top
R14  109.2,32.6 180 top
R15  108.4,29.6 270 top
R16  113.2,29.6 270 top
R17  104.4,6.2 0 top
R18  105.8,17.6 0 top
R19  100,18.6 270 top
R20  100.2,11.4 270 top
R21  109.2,4 0 top
R22  109.2,1.6 180 top
R23  118,42 90 top
R24  114.2,38.4 180 top
R25  49.8,49 270 top
R26  74.4,81 270 top
R27  67.4,62.8 90 top
R28  78.8,80.8 0 top
R29  69.8,62.8 90 top
R30  65,66.8 90 top
R31  65,62.8 90 top
R32  56,24 90 top
R33  53,24 90 top
R34  59,38.4 0 top
R35  45,37.6 270 top
R36  95,48 180 top
R37  95,50.4 180 top
R38  95,52.8 180 top
R39  95,55.2 180 top
R40  95,57.6 180 top
R41  95,60 180 top
R42  95,62.4 180 top
R43  95,64.6 180 top
R44  95.4,36.8 180 top
R45  95.4,33.2 180 top
R46  49.8,53.6 90 top
T1  92,85 90 top
T2  78.4,85.6 0 top
U$1  66.6,4.4 0 bottom
U$2  126,28.4 270 top
U$3  104.4,11.6 180 top
U$4  108,72.6 90 top
U$5  52.2,79.6 0 top
U$6  130,88 180 top
U$8  52.2,61.6 0 top
USB  107.59,51.22 90 top
USB1  124,69 180 top
USB2  124,49 180 top
X1  113.8,51 0 top
Y1  65,38.2 180 top

### Tracks (layer width: path | path; a pad name or v marks a point on that pad's centre or on a via)
3V3@1  (via drill 0.4)
  Top 0.2: v59,23 58.95,22.95 R32.1 R33.1 | v58.2,28 58.2,29.6 U$1.1
  Bottom 0.2: v59,23 59,27.2 v58.2,28
3V3_EN  (via drill 0.4)
  Top 0.2: IC6.5 54.4,84.8 55,85.4 55,85.8 55.8,86.6 57.2,86.6 57.6,87 v63,87 | v62.8,84.8 v62.8,78.6 | v62.8,75.8 62.8,69.4 v62.6,69.2 | v63.2,66.8 63,66.6 63,55.2 61.75,53.95 IC1.15
  Bottom 0.2: v63,87 63,85 v62.8,84.8 | v62.8,78.6 v62.8,75.8 | v62.6,69.2 63.2,68.6 v63.2,66.8
5V_STB  (via drill 0.4)
  Top 0.2: 64.3,47.25 64.25,47.2 | 64.2,49.75 64.25,49.8 | 60.2,52.8 56,52.8 53.8,50.6 JP3.2 51.8,50.6 51.25,50.05 R25.1 | v77.6,43.4 77.6,43.8 80.2,46.4 95.6,46.4 96.05,46.85 R36.1 R37.1 R38.1 R39.1 R40.1 R41.1 R42.1 R43.1
  Top 0.25: IC1.10 64.25,51.4 | 64.25,51.4 64.25,49.8 64.25,47.2 64.25,45.65 v63.8,45.2 62.75,46.25 IC1.26 58.45,46.25 58,45.8 58,44.6 57.6,44.2 56.65,44.2 C27.1 | IC1.38 63.75,42.95 v63.8,43 | 64.3,47.25 IC1.57 71.75,47.25 v72,47 | 64.2,49.75 IC1.19 56.7,49.75 C20.1 | C21.1 61.05,55.25 60.2,54.4 60.2,52.8 60.2,52.2 61,51.4 64.25,51.4
  Top 0.5: IC7.2 60.95,56.9 C21.1
  Bottom 0.2: v63.8,43 v63.8,45.2 | v77.6,43.4 75.6,43.4 v72,47
5VM_EN
  Top 0.2: IC3.5 53.6,66.8 53.2,67.2 49.6,67.2 49.4,67 49.4,65 50.6,63.8 52.8,63.8 53.6,63 53.6,60 54,59.6 56.4,59.6 57.4,60.6 62.2,60.6 62.6,60.2 62.6,55.4 61.25,54.05 IC1.16
5VU_EN  (via drill 0.4)
  Top 0.2: IC5.5 116.2,70.2 117.4,71.4 117.4,76.6 115.4,78.6 102.8,78.6 102,79.4 76,79.4 75.6,79.8 75.6,82.8 74.2,84.4 67,84.4 64.6,82 64.6,79 v65,78.6 | v65,75.8 65,70 66.2,68.8 66.2,67 66,66.8 64.2,66.8 63.4,66 63.4,55 62.25,53.85 IC1.14
  Bottom 0.2: v65,78.6 v65,75.8
+3V3
  Top 0.2: R7.1 49.75,86.75 48.8,85.8 48.8,83.4 48.4,83 47.45,83 C14.1
  Top 0.8: MOD1.3V3 36.18,74.02 36,74.2 36,81.4 36.4,81.8 40.2,81.8 41.4,83 42.75,83 C16.1 C15.1 | C15.1 C14.1 | U$5.P$2 47.6,79.6 45.2,82 C15.1
+5V  (via drill 0.4)
  Top 0.2: 47.45,65.8 C2.1
  Top 0.4: D+5.TP 41.8,57.2 42,57
  Top 0.5: 47.45,65.8 48.2,65.8 48.75,66.35 48.75,69.35 49,69.6 R3.1 49.2,69.85 49.2,71 49.8,71.6 55.2,71.6 60.4,76.8 65.6,76.8 v66,76.4 | D+3.TP v66,78.6
  Top 0.6: U$8.P$2 47.8,61.6 44.8,64.6 C3.1 | C3.1 C2.1 | C3.1 C4.1 42,57 42,51 55.69,37.31 U$1.4 U$1.2
  Bottom 0.5: v66,78.6 v66,76.4
+5V/1  (via drill 0.4)
  Top 0.2: C9.1 111.1,66.45 | C24.2 104.87,52.2 USB.20 105.98,52.18 106.2,52.4 106.2,58.2 106.8,58.8 116.4,58.8 117,59.4 117,60.58 R10.2 | R26.2 74.4,79.2 74.6,79 101.8,79 104.4,76.4 104.4,69.2 106.2,67.4 C10.1
  Top 0.4: R23.2 121.82,43.42 124,45.6 124,53 122.2,54.8 122.2,59.8 v122.4,60 | v115.4,60 116.38,60 R10.2
  Top 0.8: U$4.P$2 108,68.2 108.6,67.6 C8.1 | C8.1 C10.1 | C8.1 C9.1 | 111.1,66.45 112.15,66.45 112.4,66.2 112.4,64.6 112.6,64.4 113.75,64.4 R5.1 113.8,63.4 116.6,60.6 R10.2
  Bottom 0.4: v122.4,60 v115.4,60
+8V  (via drill 0.6)
  Top 0.2: R30.2 64.6,68 63.8,68.8
  Top 0.5: IC7.3 61.5,61.7 62.2,62.4 62.2,67.85
  Top 0.6: IC5.3 113.65,69.25 114,69.6 114,71.8 114.2,72 114.2,73.15 C13.1 | IC6.3 57.35,85.75 57.4,85.8 58.55,85.8 C18.1 C19.1 | IC3.3 57.35,67.75 57.4,67.8 58.55,67.8 C6.1
  Top 0.8: D2.C 110.6,87 111,86.6 111,80.2 110.8,80 v107.2,80 104.8,80 103.6,81 82,81 81.4,81.8 81.4,84.6 81.2,84.8 79.4,84.8 79.03,84.44 T2.3 T2.2 T2.1 74.05,85.85 63.8,85.85 | v107.2,77.8 113.4,77.8 114.25,76.95 C12.1 C13.1 | v63.8,75.8 63.8,68.8 62.85,67.85 62.2,67.85 C7.1 C6.1 | C19.1 63.8,85.85 | v63.8,78.6 63.8,85.85
  Bottom 0.8: v107.2,77.8 v107.2,80 | v63.8,75.8 v63.8,78.6
+12V
  Top 0.2: D5.A 113.2,79.6 112.6,79 104.4,79 103,80.2 80.2,80.2 79.91,80.69 | T2.4 79.91,80.69 | R28.2 79.61,80.4 79.91,80.69
  Top 0.8: U$6.1 120,84.8 D1.C 116,82.8 115.2,82 D5.A D2.A
  pour Top (no thermals): 111,90 111,78 121,78 121,90
D+
  Top 0.2: USB.16 102.26,54.74 D+.TP
D-
  Top 0.2: USB.15 103.02,55.38 102.8,55.6 102.8,56.6 D-.TP
GND  (via drill 0.4)
  Top 0.2: R4.1 v57.4,69.8 | IC1.20 61.15,49.25 v61.4,49 | IC1.25 61.15,46.75 v61.4,47 | IC1.41 65.25,42.55 v64.8,43 | IC1.56 69.35,46.75 v69,46.4 | IC1.9 64.75,51.25 v65,51 | R34.1 57.95,37.05 v58,37 | R35.1 46.25,38.65 v46.4,38.8 | R29.1 v69.8,60.6 | R27.1 v67.4,60.6 | v65,60.6 R31.1 | C29.1 R16.2 C28.1 R15.2 107.65,28.55 v106.8,29.4 | C35.- v100.2,2.6 | R22.1 v111.4,1.6 | IC2.2 102.2,35.6 101.35,34.75 R12.1 R11.1 | Y1.2 v65,36.6
  Top 0.35: USB.1 110.4,47 v110.4,46 | C25.1 113.75,41.75 v113.8,41.8 113.85,41.75 C26.1
  Top 0.4: IC4.6 100.33,84.33 v100.4,84.4 100.4,85.4 100.05,85.75 C1.2 | R6.1 116,63.4 v116.2,63.2
  Top 0.5: IC7.1 57.9,59.5 v57.8,59.6 | v57.6,56.8 C21.2 | C38.1 v111.4,35.6 | v116.8,35.6 C37.1 | C36.1 v119.2,34.8 | IC2.2 v104.2,35.6 | IC8.1 106.95,39.35 v106.2,38.6 | U$3.4 102.5,15.9 v102.4,16 | C32.- 115.2,9 v116.6,7.6
  Top 0.6: IC5.1 112.45,71.15 112.2,71.4 112.2,73.15 C13.2 v111,73.2 | v111,75.6 C12.2 | v106.6,59.8 106.65,59.85 C22.1 R9.1 | v100.4,54 100.4,52.25 C24.1 C23.1 | IC3.1 56.35,65.05 v56.4,65 | v58.6,64.6 C6.2 | C7.2 v60.8,64.6 | C4.2 v42,69.2 | C3.2 v44.8,69.2 | C2.2 v47.4,69.2
  Top 0.8: D1.A 118.4,86.8 U$6.2 123.2,86.8 124,86 124,84 122.8,82.8 U$6.3 | C10.2 v106.2,63.2 | v108.6,63.2 C8.2 | C9.2 v111,63.2
  Bottom 0.2: v61.4,49 v61.4,47 | v64.8,43 64.8,43.2 | v69,46.4 69,46.2 | v65,51 65,50.8 | v58,37 58,36.8 57.8,36.6 | v46.4,38.8 46.6,38.8 | v69.8,60.6 69.8,60.4 69.6,60.2 | v106.8,29.4 106.8,29.6 | v100.2,2.6 100.2,3 | v111.4,1.6 111.6,1.6 | v102.4,16 102.4,16.2 | v65,36.6 65.2,36.8
  Bottom 0.5: v111.4,35.6 v116.8,35.6 | v119.2,34.8 118.8,34.8 | v104.2,35.6 104.2,35 | v106.2,38.6 106.2,38 | v116.6,7.6 116.6,7
  other vias: 39.2,84 40.4,84 42.8,86.2 45.2,86.2 47.4,86.2 44,86.2 46.2,86.2 41.6,86.2 40.4,86.2 39.2,86.2 39.2,85 40.4,85 41.4,85 41.4,84 38,86.2 38,85 38,84 36.8,86.2 36.8,85 36.8,84 35.6,86.2 34.4,86.2 34.6,71.4 39.8,83.2 33.6,72 33.6,70.8 33.6,69.6 33,68.4 31.8,68.4 30.6,68.4 29.4,68.4 28.2,68.4 27,68.4 25.8,68.4 24.6,68.4 23.4,68.4 22.2,68.4 21,68.4 19.8,68.4 18.6,68.4 17.4,68.4 16.2,68.4 15,68.4 13.8,68.4 12.6,68.4 11.4,68.4 10.2,68.4 9,68.4 7.8,68.4 6.6,68.4 5.4,68.4 4.2,68.4 3,68.4 1.8,68.4 33.4,86.8 33.4,87.8 33.4,88.8 72.6,81.2 71.4,82.4 55,49 54.8,45.6 58,47
  pour Bottom: 130,0 96,0 96,39 129,39 129,40 95,40 95,0 0,0 0,69 33,69 33,90 130,90
  pour Top: 25.2,90 25.2,83.4 33,83.4 33,69 0,69 0,0 73,0 73,90
  pour Top (no thermals): 25.2,85 25.2,83.4 28,83.4 28,85
  pour Top (no thermals): 36.6,84.2 36.6,82.6 39.4,82.6 39.4,84.2
  pour Top: 96,0 130,0 130,39 96,39
K1
  Top 0.2: IC1.43 66.25,39.95 67.6,38.6 71.8,38.6 79.2,46 79.2,52.6 83.2,56.6 | 83.2,56.6 96.6,70 CON1.26 | R36.2 91.8,48 83.2,56.6
K2  (via drill 0.4)
  Top 0.2: IC1.44 66.75,40.05 67.8,39 71.6,39 78.8,46.2 78.8,53.8 v83,58 95.6,70.6 CON1.25 | R37.2 v92.6,50.4
  Bottom 0.2: v92.6,50.4 90.6,50.4 v83,58
K3  (via drill 0.4)
  Top 0.2: IC1.45 67.25,40.15 68,39.4 71.4,39.4 78.4,46.4 78.4,54.8 80.4,56.8 80.4,57.2 v83.6,60.4 94.6,71.4 CON1.24 | R38.2 v92.6,52.8
  Bottom 0.2: v92.6,52.8 91.2,52.8 v83.6,60.4
K4  (via drill 0.4)
  Top 0.2: IC1.46 67.75,40.25 68.2,39.8 71.2,39.8 78,46.6 78,55 80,57 80,58.6 v83.8,62.4 93.6,72.2 CON1.23 | R39.2 v92.6,55.2
  Bottom 0.2: v92.6,55.2 91,55.2 v83.8,62.4
K5
  Top 0.2: IC1.47 68.25,40.35 68.4,40.2 71,40.2 77.6,46.8 77.6,55.2 79.6,57.2 79.6,59.8 92.6,72.8 CON1.22
K6  (via drill 0.4)
  Top 0.2: IC1.48 71.5,41.3 77.2,47 77.2,55.4 79.2,57.4 79.2,61.2 v83.6,65.6 91.6,73.6 CON1.21 | R40.2 v92.6,57.6
  Bottom 0.2: v92.6,57.6 91.6,57.6 v83.6,65.6
K7  (via drill 0.4)
  Top 0.2: IC1.49 72.85,43.25 76.8,47.2 76.8,55.6 78.8,57.6 78.8,62.4 v84,67.6 90.6,74.2 CON1.20 | R41.2 v92.6,60
  Bottom 0.2: v92.6,60 91.6,60 v84,67.6
K8  (via drill 0.4)
  Top 0.2: IC1.50 72.75,43.75 76.4,47.4 76.4,55.8 78.4,57.8 78.4,63.6 v84,69.2 89.6,74.8 CON1.19 | R42.2 v92.6,62.4
  Bottom 0.2: v92.6,62.4 90.8,62.4 v84,69.2
K9  (via drill 0.4)
  Top 0.2: IC1.51 72.65,44.25 76,47.6 76,56 78,58 78,64.6 v84.2,70.8 87,73.6 87.4,73.6 88.6,74.8 CON1.18 | R43.2 v92.6,64.6
  Bottom 0.2: v92.6,64.6 90.4,64.6 v84.2,70.8
K10
  Top 0.2: CON1.17 87.6,74.8 87.4,74.6 87.2,74.4 86.4,74.4 77.6,65.6 77.6,64.8 77.6,58.2 75.6,56.2 75.6,47.8 72.55,44.75 IC1.52
K12
  Top 0.2: IC1.53 72.45,45.25 75.2,48 75.2,56.4 77.2,58.4 77.2,66.4 85.6,74.8 CON1.15
K13
  Top 0.2: IC1.54 72.35,45.75 74.8,48.2 74.8,56.6 76.8,58.6 76.8,67 84.6,74.8 CON1.14
K14
  Top 0.2: IC1.55 72.25,46.25 74.4,48.4 74.4,56.8 76.4,58.8 76.4,67.6 83.6,74.8 CON1.13
K15
  Top 0.2: IC1.58 71.95,47.75 74,49.8 74,57 76,59 76,68.2 82.6,74.8 CON1.12
K16
  Top 0.2: IC1.59 71.85,48.25 73.6,50 73.6,57.2 75.6,59.2 75.6,68.8 81.6,74.8 CON1.11
K17
  Top 0.2: IC1.60 71.75,48.75 73.2,50.2 73.2,57.4 75.2,59.4 75.2,69.4 80.6,74.8 CON1.10
K18
  Top 0.2: IC1.61 71.65,49.25 72.8,50.4 72.8,57.6 74.8,59.6 74.8,70 79.6,74.8 CON1.9
K19
  Top 0.2: IC1.62 71.55,49.75 72.4,50.6 72.4,57.8 74.4,59.8 74.4,70.6 78.6,74.8 CON1.8
K20
  Top 0.2: IC1.63 71.45,50.25 72,50.8 72,58 74,60 74,71.2 77.6,74.8 CON1.7
K21
  Top 0.2: IC1.64 71.35,50.75 71.6,51 71.6,58.2 73.6,60.2 73.6,71.8 76.6,74.8 CON1.6
K22
  Top 0.2: IC1.1 68.75,55.95 73.2,60.4 73.2,72.4 75.6,74.8 CON1.5
K23
  Top 0.2: IC1.2 68.25,56.05 72.8,60.6 72.8,73 74.6,74.8 CON1.4
K24
  Top 0.2: IC1.3 67.75,56.15 72.4,60.8 72.4,73.6 73.6,74.8 CON1.3
K25
  Top 0.2: IC1.4 67.25,56.25 72,61 72,74 72.6,74.6 CON1.2
K26
  Top 0.2: IC1.5 66.75,56.35 71.6,61.2 CON1.1
M1  (via drill 0.4)
  Top 0.2: IC1.33 61.25,38.35 60.1,38.35 R34.2 60,38.35 60,37.2 59.6,36.8 59.6,27.6 58.8,26.8 v54.2,26.8 | v50.6,27.8 U$1.7
  Bottom 0.2: v54.2,26.8 51.6,26.8 v50.6,27.8
M2
  Top 0.2: IC1.36 62.75,36.45 63.6,35.6 65.4,35.6 67.8,33.2 67.8,26 63.6,21.8 51.8,21.8 45.53,28.07 U$1.11 45.53,29.73 46.8,31 46.8,33.8 45,35.6 R35.2
MRX  (via drill 0.4)
  Top 0.2: IC1.32 58.25,43.25 v56.6,41.6 | v52,37 51.8,37 50.6,35.8 U$1.8
  Bottom 0.2: v56.6,41.6 v52,37
MSCL
  Top 0.2: IC1.34 61.75,36.05 63,34.8 65,34.8 67,32.8 67,29 64.2,26.2 55.2,26.2 54,25 53.05,25 R33.2 53.15,25.2 U$1.5
MSDA  (via drill 0.4)
  Top 0.2: IC1.35 62.25,36.15 63.2,35.2 65.2,35.2 67.4,33 67.4,28.6 64.6,25.8 58.6,25.8 58,25.2 | 58,25.2 56.15,25.2 R32.2 | U$1.3 55.69,28.11 v56,27.8 | v58,24.2 58,25.2
  Bottom 0.2: v56,27.8 56,26.2 v58,24.2
MTX  (via drill 0.4)
  Top 0.2: U$1.10 48.07,32.27 50.2,34.4 50.2,36.6 v51.4,37.8 | v56,42.4 56.8,42.4 58.15,43.75 IC1.31
  Bottom 0.2: v51.4,37.8 v56,42.4
N$1
  Top 0.2: C5.2 50.35,64.65 50.6,64.4 55.2,64.4
  Top 0.6: IC3.2 55.4,66.8 55.2,66.6 55.2,64.4 55.2,61.7 U$8.P$1
N$2
  Top 0.2: IC4.2 104.47,83.67 105.2,84.4 105.98,84.4 R1.1 106,86 105.05,86.95 R2.1
  Top 0.8: R1.1 107.78,84.42 108.8,83.4 D5.C
N$3
  Top 0.2: IC4.1 105.78,83.03 106,82.8 R1.2
  Top 0.8: R1.2 105,81.6 104.42,82.18 95.22,82.18 94.6,82.8 T1.1 T1.2 T1.3
N$4
  Top 0.2: IC4.8 96.58,83.03 96.2,83.4 96.2,86.6 95.89,86.91 T1.4
N$5
  Top 0.2: IC4.4 103.35,86.45 103,86.8 103,87.95 R2.2
N$6
  Top 0.2: IC4.5 98.65,86.35 98,87 98,87.95 C1.1
N$7
  Top 0.2: IC4.7 96.72,83.67 96.6,83.8 96.6,87 96,87.6 92.2,87.6 91.5,86.91 T1.5
  Top 0.8: 89.3,86.8 87.8,86.8 87.54,86.54 JP2.1 82.86,86.54 81.2,88 T2.5 T2.6 T2.7 T2.8 | 89.3,86.8 T1.5 | 89.3,86.8 89.3,85.74 T1.6 T1.7 T1.8
  pour Top (no thermals): 74,90 74,85 88,85 88,82 96,82 96,90
N$8
  Top 0.2: USB.9 117.82,52.18 120,50 USB2.D+
N$9
  Top 0.2: USB.8 117.74,51.54 USB2.D-
N$10
  Top 0.2: USB.10 112.22,52.82 118.6,59.2 118.6,66.6 120,68 USB1.D-
N$11
  Top 0.2: USB.11 112.26,53.46 118.2,59.4 118.2,66.92 USB1.D+
N$12
  Top 0.2: USB.13 109.26,54.74 108.8,55.2 108.8,56.95 C22.2 107.4,57.15 107.4,52.8 106.14,51.54 USB.21 103.74,51.54 103.2,51 101.4,51 | USB.26 102.46,48.34 101.4,49.4 101.4,51 | 101.4,51 101.4,53.4 102.1,54.1 USB.17 USB.18 USB.19
N$13
  Top 0.2: IC3.6 52.6,65.85 C5.1
N$14
  Top 0.2: R3.2 R4.2 54,69.75 54,68.4 54.05,68.35 IC3.4
N$15
  Top 0.2: USB.12 108.5,54.1 108,53.6 108,52.6 106.2,50.8 106.2,47.4 105.86,47.06 USB.28 102.51,47.06 C23.2
N$16
  Top 0.2: R9.2 110.2,55.47 USB.14
N$17  (via drill 0.4)
  Top 0.2: IC5.2 113.2,70.2 113.4,70.4 113.4,74.2 v113.2,74.4 | v116.2,76 C11.2
  Top 0.6: U$4.P$1 108,73.8 111.6,70.2 IC5.2
  Bottom 0.2: v113.2,74.4 114.6,74.4 v116.2,76
N$18
  Top 0.2: USB.2 111.9,47.7 112.6,47 112.6,46.5 X1.P$1 112.4,46.36 C25.2
N$19
  Top 0.2: IC5.6 115.55,71.15 116.2,71.8 C11.1
N$20
  Top 0.2: R5.2 R6.2 116,67.4 114.95,68.25 IC5.4
N$21
  Top 0.2: USB.3 114.66,48.34 115,48 115,46.5 X1.P$2 115.2,46.3 C26.2
N$22
  Top 0.2: C17.2 50.15,83.25 50.8,82.6 55.2,82.6
  Top 0.6: IC6.2 55.4,84.8 55.2,84.6 55.2,82.6 55.2,79.7 U$5.P$1
N$23
  Top 0.8: R10.1 121.2,60.6 | 121.2,60.6 121.2,65.42 USB1.VBUS | 121.2,60.6 121.2,54.4 123,52.6 123,46.2 122.4,45.6 121.38,45.6 USB2.VBUS
N$24
  Top 0.2: IC6.6 52.4,83.85 C17.1
N$25
  Top 0.2: R7.2 R8.2 53.95,86.65 54,86.6 54,85.8 IC6.4
N$29
  Top 0.2: IC2.6 106.55,36.55 106.8,36.8 106.8,38 107.2,38.4 109,38.4 109.2,38.2 109.2,37.4 109.6,37 111.6,37 112.2,36.4 112.2,33 112.6,32.6 R13.2
N$30
  Top 0.2: IC2.4 106.35,34.65 106.8,34.2 106.8,33 107.2,32.6 R14.2
N$31
  Top 0.2: R13.1 115.85,30.7 C29.2 | C29.2 R16.1 | U$2.T2 117.8,26.4 117.4,26.8 117.4,30.4 117.2,30.6 115.85,30.6 C29.2
N$32
  Top 0.2: R14.1 110.25,31.75 110.8,31.2 C28.2 | R15.1 C28.2 | C28.2 111.75,30.65 112,30.4 112,29.8 112.2,29.6 116.8,29.6 117,29.4 117,24.8 117.4,24.4 U$2.T1
N$33
  Top 0.6: MOD1.ANT 20.2,81.55 ANT1.1
N$34
  Top 0.2: C30.- 116.6,22.8 116.8,22.6 116.8,18.4 118.4,16.8 JP1.TIP
N$35
  Top 0.2: C31.- 116.6,15.8 117,15.4 117,9.4 119.6,6.8 JP1.RING
N$36
  Top 0.2: U$3.1 106.31,15.9 106.8,16.4 106.8,17.55 R18.2 106.85,21.45 108.2,22.8 C30.+
N$37
  Top 0.2: R17.2 105.4,6.25 105.4,7.4 105.03,7.76 U$3.7 105.03,11.44 105.4,11.8 107,11.8 107.4,12.2 107.4,15.4 107.8,15.8 C31.+
N$38
  Top 0.2: R22.2 R21.1 108.15,3.75 107,2.6 C35.+ 105.6,3.8 105,4.4 102.8,4.4 102.2,5 102.2,7.2 102.5,7.5 U$3.5 101.8,9 101.2,8.4 99.4,8.4 99,8.8 99,11.2 99.2,11.4 102.6,11.4 103.77,12.56 U$3.3
N$39
  Top 0.2: R19.2 100.05,17.6 R18.1 104.8,17.55 104.8,16.4 105.03,16.16 U$3.2
N$40
  Top 0.2: R17.1 103.4,6.25 103.4,7.4 103.77,7.76 U$3.6 103.77,10.23 103.2,10.8 101.6,10.8 101.15,10.35 R20.2
N$41
  Top 0.2: C33.+ 101,27.6 100,26.6 R19.1
N$42
  Top 0.2: R20.1 100.2,14.6 98.8,16 98.8,18.4 99,18.6 101.2,18.6 101.4,18.8 101.4,21 102.4,22 C34.+
N$43  (via drill 0.4)
  Top 0.2: v115.6,26.8 115.2,26.4 106.6,26.4 105.6,25.4 C34.-
  Bottom 0.2: U$2.W2 117.2,28.4 v115.6,26.8
N$44  (via drill 0.4)
  Top 0.2: v114.4,27.2 107.4,27.2 107,27.6 C33.-
  Bottom 0.2: U$2.W1 117.6,30.4 v114.4,27.2
N$45
  Top 0.2: USB.7 109.3,50.9 109.2,50.8 108.6,50.8 107.2,49.4 107.2,46.8 106.4,46 99.4,46 99,46.4 99,66.2 103.8,71 103.8,76.2 101.4,78.6 70,78.6 69.6,79 D+1.TP
N$46
  Top 0.2: USB.6 108.66,50.26 107.6,49.2 107.6,46.6 106.6,45.6 99.2,45.6 98.6,46.2 98.6,66.4 103.4,71.2 103.4,76 101.2,78.2 68.2,78.2 67.6,78.8 D+2.TP
N$47
  Top 0.5: R23.1 118.62,40.58 119.2,40 C36.2 119.05,38.4 R24.1
N$48  (via drill 0.4)
  Top 0.2: R26.1 74.2,82.2 v74.2,83.4 | v69.2,76.2 69.2,76 69.8,75.4 70,75.4 70.2,75.2 70.2,66.6 69,65.4 68,65.4 67.4,64.8 R27.2 66.45,63.85 66.2,63.6 66.2,60.2 64.2,58.2 64.2,54.6 63.25,53.65 IC1.12
  Bottom 0.2: v74.2,83.4 73.8,83 73.8,78.4 72.8,77.4 70.4,77.4 v69.2,76.2
N$49  (via drill 0.4)
  Top 0.2: v62.8,50.6 61,50.6 59.2,52.4 56.4,52.4 53.6,49.6 52.2,49.6 51.8,49.2 51.8,48.2 51.4,47.8 | R25.2 51.25,47.95 51.4,47.8 | 51.4,47.8 51.4,47.2 52,46.6 JP3.4
  Top 0.25: IC1.7 65.75,50.45 v66,50.2
  Bottom 0.2: v66,50.2 63.2,50.2 v62.8,50.6
N$50
  Top 0.2: IC1.37 63.25,42.15 63,42.4 60.6,42.4 58.6,40.4 54.4,40.4 52.8,42 JP3.5
N$51
  Top 0.2: JP3.3 53.6,48.6 53.8,48.4 53.8,41.6 54.6,40.8 58.4,40.8 61.6,44 65,44 65.75,43.25 IC1.42
N$52  (via drill 0.4)
  Top 0.2: R28.1 v76.6,80.8 | v70.2,76.2 70.2,76 70.6,75.6 70.6,66 69.8,65.2 R29.2 68.85,63.85 68.6,63.6 68.6,60.2 64.6,56.2 64.6,54.4 63.75,53.55 IC1.11
  Bottom 0.2: v76.6,80.8 76.6,79.4 74,76.8 70.8,76.8 v70.2,76.2
N$53
  Top 0.2: IC1.40 64.75,40.05 65,39.8 65.8,39.8 66.2,39.4 Y1.1
N$54
  Top 0.2: IC1.39 64.25,39.85 63.8,39.4 Y1.3
N$55
  Top 0.2: R30.1 R31.2 64.05,63.85 63.8,63.6 63.8,54.8 62.75,53.75 IC1.13
N$57
  Top 0.2: D+6.TP D+8.TP
N$58
  Top 0.2: R45.1 97.2,33.2 99.6,30.8 100.55,30.8 R11.2 100.65,30.8 101.6,30.8 102,31.2 102,34.4 102.25,34.65 IC2.3
N$59
  Top 0.2: R44.1 100.55,36.8 R12.2 100.65,36.8 101.8,36.8 102.05,36.55 IC2.1
N$60
  Top 0.2: LED1.C 49.85,54.6 R46.2
N$61  (via drill 0.4)
  Top 0.2: IC1.18 58.15,50.25 57.8,50.6 v57.8,51.4 | v58.8,54.6 LED1.A
  Bottom 0.2: v57.8,51.4 57.8,53.6 v58.8,54.6
PWM0  (via drill 0.4)
  Top 0.2: U$1.12 45.53,31.88 44.25,30.6 44.25,28.35 51.6,21 74.2,21 87.4,34.2 v87.4,35 | v89.2,33.2 R45.2
  Bottom 0.2: v87.4,35 v89.2,33.2
PWM1
  Top 0.2: U$1.33 17.59,28.41 18.8,27.2 44.6,27.2 51.4,20.4 74.4,20.4 90.8,36.8 R44.2
V25A
  Top 0.5: IC8.2 108.1,36.7 108,36.6 108,35.65 C38.2
  Top 0.6: IC2.5 C38.2
V50A  (via drill 0.4)
  Top 0.2: C32.+ 109.8,6 110.2,5.6 110.2,4.05 R21.2 | 113.2,35.55 C37.2
  Top 0.5: IC8.3 R24.2 C37.2 | U$3.8 C32.+ 109.8,12.2 112.2,14.6 v112.2,25.2 | v113.2,34.2 113.2,35.55
  Bottom 0.5: v112.2,25.2 112.2,33.2 v113.2,34.2
WL_D+
  Top 0.2: MOD1.D+ 38.02,80.6 39.8,80.6 45.4,75 56.2,75 59,77.8 99.4,77.8 99.8,77.4 99.8,73.6 98.2,72 98.2,46 99,45.2 106.8,45.2 108,46.4 108,49 108.62,49.62 USB.5
WL_D-
  Top 0.2: MOD1.D- 38,78.2 39,79.2 40.6,79.2 45.2,74.6 56.4,74.6 59.2,77.4 99,77.4 99.4,77 99.4,73.8 97.8,72.2 97.8,45.8 98.8,44.8 107,44.8 108.4,46.2 108.4,48.8 108.8,49.2 109,49.2 109.2,48.98 USB.4

### Text on the board
Top: RPZC_v1